# Altium schematic sheet CanTrans.SchDoc
size A; SheetNumber: 6; SheetTotal: 12
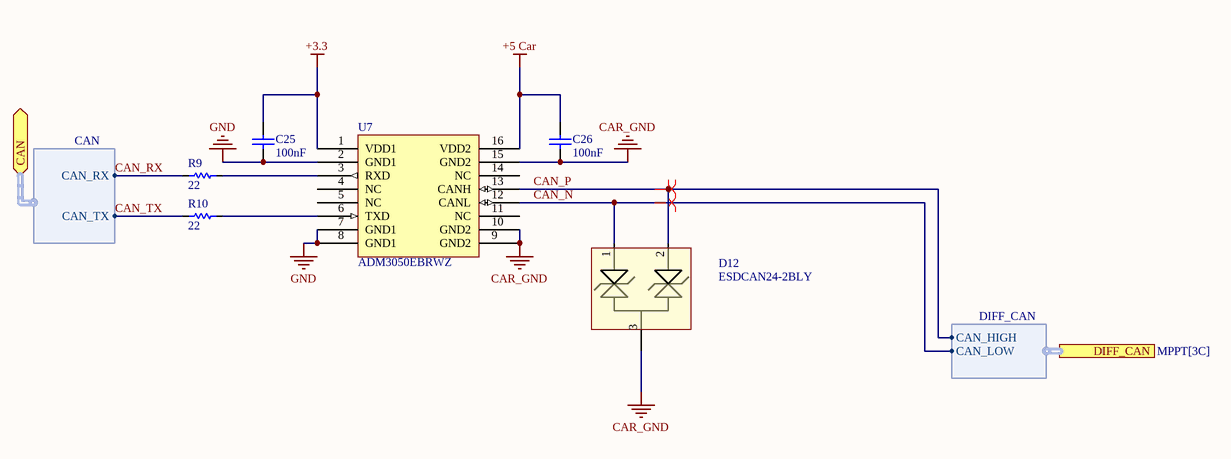
[diagram p0: CanTrans.SchDoc]

## Parts
C25  value 100nF  [CAPC1608X90X40ML10T20]  (hidden comment: Capacitor 0.1uF +/-10% 50 V 0603)
C26  value 100nF  [CAPC1608X90X40ML10T20]  (hidden comment: Capacitor 0.1uF +/-10% 50 V 0603)
D12  ESDCAN24-2BLY  [SOT23-3]
R9  value 22  [0603_RESISTOR]  (hidden comment: Res 0603 22.1 ohm 1%)
R10  value 22  [0603_RESISTOR]  (hidden comment: Res 0603 22.1 ohm 1%)
U7  ADM3050EBRWZ  [SOIC127P1030X265-16N]

## Ports
CAN (bidir, harness CAN, see MPPT[3C], MicroController[4A]), DIFF_CAN (harness DIFF_CAN, see MPPT[3C])

## Harnesses
CAN: CAN_TX, CAN_RX
DIFF_CAN: CAN_HIGH, CAN_LOW

## Nets
+3.3: C25.2 U7.1(VDD1)
+5 Car: C26.1 U7.16(VDD2)
CAR_GND: C26.2 D12.3 U7.9(GND2) U7.10(GND2) U7.15(GND2)
GND: C25.1 U7.2(GND1) U7.7(GND1) U7.8(GND1)
CAN_N: D12.1 U7.12(CANL) ; port DIFF_CAN.CAN_LOW
CAN_P: D12.2 U7.13(CANH) ; port DIFF_CAN.CAN_HIGH
CAN_RX: R9.1 ; port CAN.CAN_RX
CAN_TX: R10.1 ; port CAN.CAN_TX
NetR9_2: R9.2 U7.3(RXD)
NetR10_2: R10.2 U7.6(TXD)

Not connected (* = marked no-connect by the designer): U7 4(NC) 5(NC) 11(NC) 14(NC)

## Layout directives
differential pair: CAN_N, CAN_P

## Library data of the parts
C25 C26 = CMP-001-00017-10: Chip Capacitor, 0.1uF, +/- 10%, 50 V, 0603 (1608 Metric); Voltage Rating: 50V; Capacitor Type: Ceramic; Max Operating Temperature: 125°C; Case/Package: 0603; Mounting Technology: SMT; Pins: 2; Tolerance: 10%; Min Operating Temperature: -55°C
D12 = CMP-004-00032-2: ESD Suppressor TVS 24V Automotive 3-Pin SOT-23 T/R; Max Power Dissipation: 230W; Number of Channels: 2; Capacitance: 30pF; Leakage Current: 100nA; Polarity: Bidirectional; ESD Protection: Yes; Clamping Voltage: 43V; Diode Type: ZENER; Breakdown Voltage: 27V; Peak Pulse Current: 5.5A; Min Breakdown Voltage: 26.2V; Element Configuration: Dual; Power Line Protection: No; Height: 1.4mm; Mount: Surface Mount; Termination: SMD/SMT; Number of Pins: 3; Resistor Type: Zener; RoHS Compliant: Yes; Number of Bidirectional Channels: 2; Working Voltage: 24V; Min Operating Temperature: -40°C; REACH SVHC: No SVHC; Width: 1.75mm; Reverse Standoff Voltage: 24V; Case/Package: SOT-23; Series: Automotive, AEC-Q101, ESDCAY, TRANSIL™; Radiation Hardening: No; Package Quantity: 1; Direction: Bidirectional; Peak Pulse Power: 230W; Max Reverse Leakage Current: 100nA; Max Operating Temperature: 150°C; Length: 2.9mm; Depth: 1.3mm; Packaging: Tape and Reel; Lead Free: Lead Free
R9 R10 = CMP-058-000007-6: RES 22 OHM 1/16W 1% 0603 SMD; Power: 62.5mW; Tolerance: 1%; Case/Package: 0603; Mounting Technology: SMD; Pins: 2
U7 = CMP-015-00019-2: MIL-STD-1553 Data Bus Transceiver, PDSO16. Isolated CANFD transceiver; Nominal Supply Voltage: 5V; Max Supply Voltage: 5.5V; Min Supply Voltage: 1.7V; Case/Package: SOIC-16; Mounting Technology: SMD; RoHS Compliant: Yes; Max Operating Temperature: 125°C; Pins: 16; Min Operating Temperature: -45°C